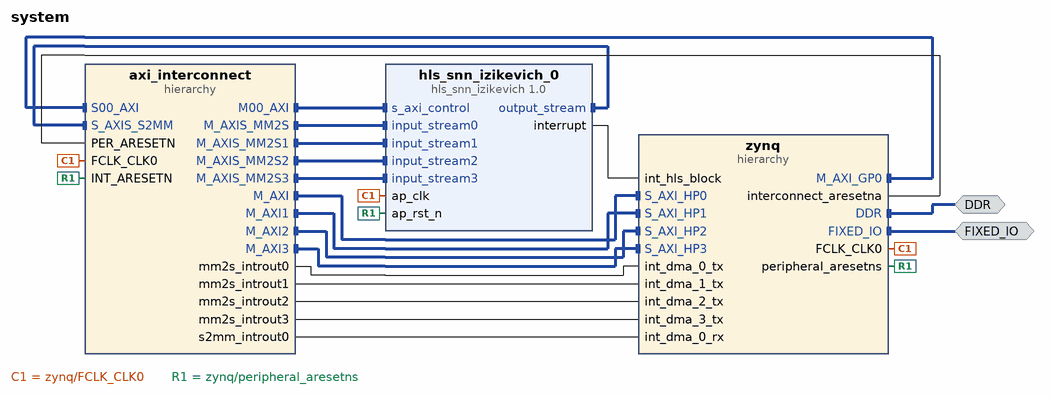
[diagram p0: block diagram of the top level]
# Vivado block design system, Vivado 2015.4
create_bd_design system

create_bd_intf_port -mode Master -vlnv xilinx.com:interface:ddrx_rtl:1.0 DDR
create_bd_intf_port -mode Master -vlnv xilinx.com:display_processing_system7:fixedio_rtl:1.0 FIXED_IO

create_bd_cell -type hier zynq
create_bd_cell -type hier axi_interconnect
create_bd_cell -type ip -vlnv xilinx.com:hls:hls_snn_izikevich:1.0 hls_snn_izikevich_0

# ---- hierarchy /zynq ----
current_bd_instance /zynq
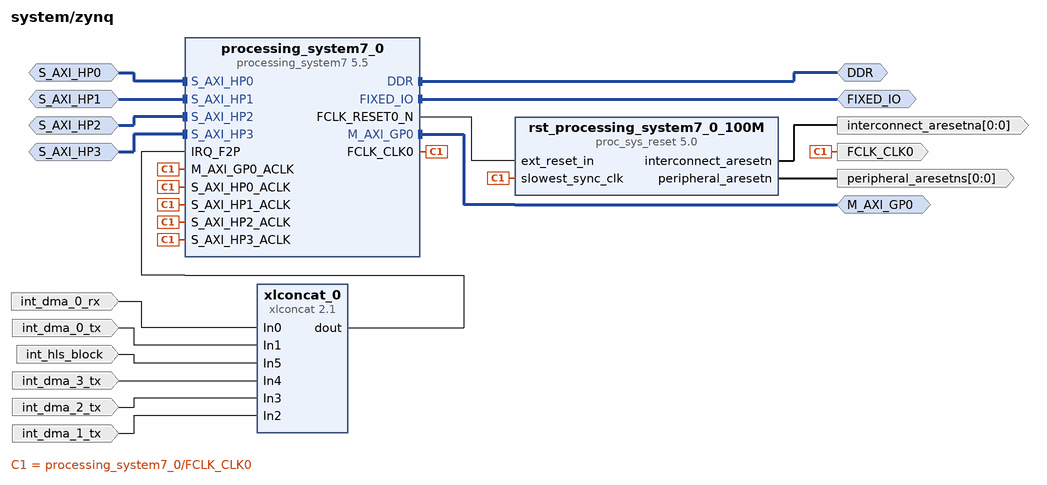
[diagram p1: block diagram inside /zynq]
create_bd_intf_pin -mode Master -vlnv xilinx.com:interface:ddrx_rtl:1.0 DDR
create_bd_intf_pin -mode Master -vlnv xilinx.com:display_processing_system7:fixedio_rtl:1.0 FIXED_IO
create_bd_intf_pin -mode Master -vlnv xilinx.com:interface:aximm_rtl:1.0 M_AXI_GP0
create_bd_intf_pin -mode Slave -vlnv xilinx.com:interface:aximm_rtl:1.0 S_AXI_HP0
create_bd_intf_pin -mode Slave -vlnv xilinx.com:interface:aximm_rtl:1.0 S_AXI_HP1
create_bd_intf_pin -mode Slave -vlnv xilinx.com:interface:aximm_rtl:1.0 S_AXI_HP2
create_bd_intf_pin -mode Slave -vlnv xilinx.com:interface:aximm_rtl:1.0 S_AXI_HP3
create_bd_pin -dir O -type clk FCLK_CLK0
create_bd_pin -dir O -from 0 -to 0 -type rst peripheral_aresetns
create_bd_pin -dir I int_dma_0_rx
create_bd_pin -dir I int_dma_0_tx
create_bd_pin -dir I int_dma_1_tx
create_bd_pin -dir I int_dma_2_tx
create_bd_pin -dir I int_dma_3_tx
create_bd_pin -dir I int_hls_block
create_bd_pin -dir O -from 0 -to 0 -type rst interconnect_aresetna

create_bd_cell -type ip -vlnv xilinx.com:ip:proc_sys_reset:5.0 rst_processing_system7_0_100M
create_bd_cell -type ip -vlnv xilinx.com:ip:processing_system7:5.5 processing_system7_0
set_property -dict [list \
  CONFIG.PCW_FPGA0_PERIPHERAL_FREQMHZ 100 \
  CONFIG.PCW_USE_S_AXI_HP0 1 \
  CONFIG.PCW_USE_S_AXI_HP1 1 \
  CONFIG.PCW_USE_S_AXI_HP2 1 \
  CONFIG.PCW_USE_S_AXI_HP3 1 \
  CONFIG.PCW_USE_FABRIC_INTERRUPT 1 \
  CONFIG.PCW_IRQ_F2P_INTR 1 \
  CONFIG.preset ZedBoard \
] [get_bd_cells processing_system7_0]
create_bd_cell -type ip -vlnv xilinx.com:ip:xlconcat:2.1 xlconcat_0
set_property -dict {CONFIG.NUM_PORTS 6} [get_bd_cells xlconcat_0]

# ---- hierarchy /axi_interconnect ----
current_bd_instance /axi_interconnect
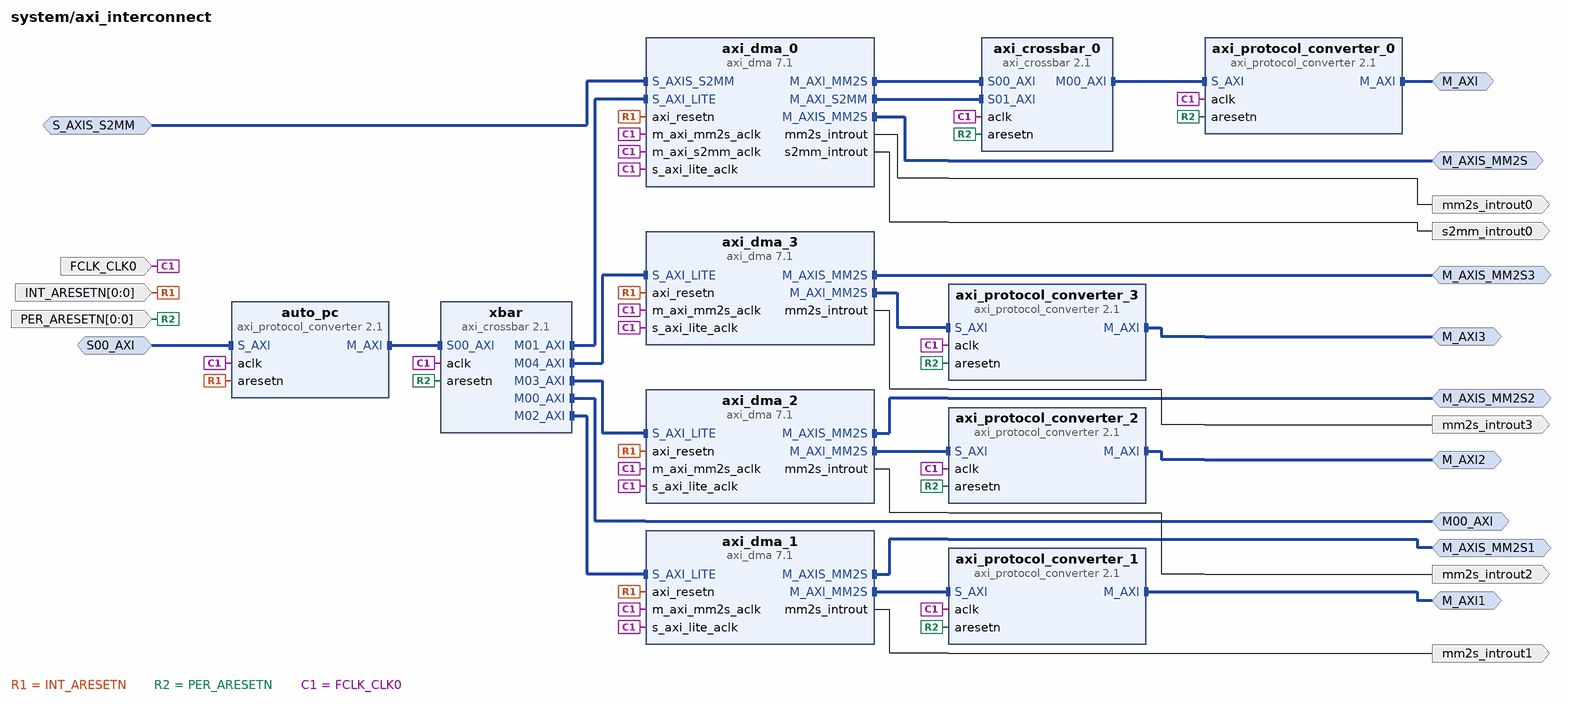
[diagram p2: block diagram inside /axi_interconnect]
create_bd_intf_pin -mode Slave -vlnv xilinx.com:interface:aximm_rtl:1.0 S00_AXI
create_bd_intf_pin -mode Slave -vlnv xilinx.com:interface:axis_rtl:1.0 S_AXIS_S2MM
create_bd_intf_pin -mode Master -vlnv xilinx.com:interface:aximm_rtl:1.0 M00_AXI
create_bd_intf_pin -mode Master -vlnv xilinx.com:interface:axis_rtl:1.0 M_AXIS_MM2S
create_bd_intf_pin -mode Master -vlnv xilinx.com:interface:axis_rtl:1.0 M_AXIS_MM2S1
create_bd_intf_pin -mode Master -vlnv xilinx.com:interface:axis_rtl:1.0 M_AXIS_MM2S2
create_bd_intf_pin -mode Master -vlnv xilinx.com:interface:axis_rtl:1.0 M_AXIS_MM2S3
create_bd_intf_pin -mode Master -vlnv xilinx.com:interface:aximm_rtl:1.0 M_AXI
create_bd_intf_pin -mode Master -vlnv xilinx.com:interface:aximm_rtl:1.0 M_AXI1
create_bd_intf_pin -mode Master -vlnv xilinx.com:interface:aximm_rtl:1.0 M_AXI2
create_bd_intf_pin -mode Master -vlnv xilinx.com:interface:aximm_rtl:1.0 M_AXI3
create_bd_pin -dir I -type clk FCLK_CLK0
create_bd_pin -dir I -from 0 -to 0 -type rst INT_ARESETN
create_bd_pin -dir I -from 0 -to 0 -type rst PER_ARESETN
create_bd_pin -dir O s2mm_introut0
create_bd_pin -dir O mm2s_introut0
create_bd_pin -dir O mm2s_introut1
create_bd_pin -dir O mm2s_introut2
create_bd_pin -dir O mm2s_introut3

create_bd_cell -type ip -vlnv xilinx.com:ip:axi_crossbar:2.1 axi_crossbar_0
set_property -dict {CONFIG.NUM_SI 2 CONFIG.NUM_MI 1} [get_bd_cells axi_crossbar_0]
create_bd_cell -type ip -vlnv xilinx.com:ip:axi_protocol_converter:2.1 axi_protocol_converter_0
create_bd_cell -type ip -vlnv xilinx.com:ip:axi_protocol_converter:2.1 axi_protocol_converter_1
create_bd_cell -type ip -vlnv xilinx.com:ip:axi_dma:7.1 axi_dma_0
set_property -dict [list \
  CONFIG.c_include_sg 0 \
  CONFIG.c_m_axi_mm2s_data_width 64 \
  CONFIG.c_m_axis_mm2s_tdata_width 64 \
  CONFIG.c_include_mm2s_dre 1 \
  CONFIG.c_mm2s_burst_size 256 \
  CONFIG.c_include_s2mm_dre 1 \
  CONFIG.c_s2mm_burst_size 256 \
] [get_bd_cells axi_dma_0]
create_bd_cell -type ip -vlnv xilinx.com:ip:axi_protocol_converter:2.1 axi_protocol_converter_2
create_bd_cell -type ip -vlnv xilinx.com:ip:axi_dma:7.1 axi_dma_1
set_property -dict [list \
  CONFIG.c_include_sg 0 \
  CONFIG.c_m_axi_mm2s_data_width 64 \
  CONFIG.c_m_axis_mm2s_tdata_width 64 \
  CONFIG.c_include_mm2s_dre 1 \
  CONFIG.c_mm2s_burst_size 256 \
  CONFIG.c_include_s2mm 0 \
] [get_bd_cells axi_dma_1]
create_bd_cell -type ip -vlnv xilinx.com:ip:axi_protocol_converter:2.1 axi_protocol_converter_3
create_bd_cell -type ip -vlnv xilinx.com:ip:axi_dma:7.1 axi_dma_2
set_property -dict [list \
  CONFIG.c_include_sg 0 \
  CONFIG.c_m_axi_mm2s_data_width 64 \
  CONFIG.c_m_axis_mm2s_tdata_width 64 \
  CONFIG.c_include_mm2s_dre 1 \
  CONFIG.c_mm2s_burst_size 256 \
  CONFIG.c_include_s2mm 0 \
] [get_bd_cells axi_dma_2]
create_bd_cell -type ip -vlnv xilinx.com:ip:axi_dma:7.1 axi_dma_3
set_property -dict [list \
  CONFIG.c_include_sg 0 \
  CONFIG.c_m_axi_mm2s_data_width 64 \
  CONFIG.c_m_axis_mm2s_tdata_width 64 \
  CONFIG.c_include_mm2s_dre 1 \
  CONFIG.c_mm2s_burst_size 256 \
  CONFIG.c_include_s2mm 0 \
] [get_bd_cells axi_dma_3]
create_bd_cell -type ip -vlnv xilinx.com:ip:axi_crossbar:2.1 xbar
set_property -dict {CONFIG.NUM_SI 1 CONFIG.NUM_MI 5 CONFIG.STRATEGY 0} [get_bd_cells xbar]
create_bd_cell -type ip -vlnv xilinx.com:ip:axi_protocol_converter:2.1 auto_pc
set_property -dict {CONFIG.SI_PROTOCOL AXI3 CONFIG.MI_PROTOCOL AXI4LITE} [get_bd_cells auto_pc]

# ---- connections ----

current_bd_instance /zynq
connect_bd_intf_net [get_bd_intf_pins DDR] [get_bd_intf_pins processing_system7_0/DDR]
connect_bd_intf_net [get_bd_intf_pins FIXED_IO] [get_bd_intf_pins processing_system7_0/FIXED_IO]
connect_bd_intf_net [get_bd_intf_pins M_AXI_GP0] [get_bd_intf_pins processing_system7_0/M_AXI_GP0]
connect_bd_intf_net -intf_net S_AXI_HP0_1 [get_bd_intf_pins S_AXI_HP0] [get_bd_intf_pins processing_system7_0/S_AXI_HP0]
connect_bd_intf_net -intf_net S_AXI_HP1_1 [get_bd_intf_pins S_AXI_HP1] [get_bd_intf_pins processing_system7_0/S_AXI_HP1]
connect_bd_intf_net -intf_net S_AXI_HP2_1 [get_bd_intf_pins S_AXI_HP2] [get_bd_intf_pins processing_system7_0/S_AXI_HP2]
connect_bd_intf_net -intf_net S_AXI_HP3_1 [get_bd_intf_pins S_AXI_HP3] [get_bd_intf_pins processing_system7_0/S_AXI_HP3]
connect_bd_net [get_bd_pins processing_system7_0/FCLK_RESET0_N] [get_bd_pins rst_processing_system7_0_100M/ext_reset_in]
connect_bd_net [get_bd_pins processing_system7_0/FCLK_CLK0] \
  [get_bd_pins FCLK_CLK0] [get_bd_pins processing_system7_0/S_AXI_HP0_ACLK] [get_bd_pins processing_system7_0/M_AXI_GP0_ACLK] \
  [get_bd_pins rst_processing_system7_0_100M/slowest_sync_clk] [get_bd_pins processing_system7_0/S_AXI_HP1_ACLK] \
  [get_bd_pins processing_system7_0/S_AXI_HP2_ACLK] [get_bd_pins processing_system7_0/S_AXI_HP3_ACLK]
connect_bd_net [get_bd_pins rst_processing_system7_0_100M/peripheral_aresetn] [get_bd_pins peripheral_aresetns]
connect_bd_net [get_bd_pins xlconcat_0/dout] [get_bd_pins processing_system7_0/IRQ_F2P]
connect_bd_net -net In0_1 [get_bd_pins int_dma_0_rx] [get_bd_pins xlconcat_0/In0]
connect_bd_net -net In1_1 [get_bd_pins int_dma_0_tx] [get_bd_pins xlconcat_0/In1]
connect_bd_net -net In5_1 [get_bd_pins int_hls_block] [get_bd_pins xlconcat_0/In5]
connect_bd_net -net In4_1 [get_bd_pins int_dma_3_tx] [get_bd_pins xlconcat_0/In4]
connect_bd_net -net In3_1 [get_bd_pins int_dma_2_tx] [get_bd_pins xlconcat_0/In3]
connect_bd_net -net In2_1 [get_bd_pins int_dma_1_tx] [get_bd_pins xlconcat_0/In2]
connect_bd_net [get_bd_pins rst_processing_system7_0_100M/interconnect_aresetn] [get_bd_pins interconnect_aresetna]

current_bd_instance /axi_interconnect
connect_bd_intf_net [get_bd_intf_pins axi_crossbar_0/S00_AXI] [get_bd_intf_pins axi_dma_0/M_AXI_MM2S]
connect_bd_intf_net [get_bd_intf_pins axi_protocol_converter_0/S_AXI] [get_bd_intf_pins axi_crossbar_0/M00_AXI]
connect_bd_intf_net [get_bd_intf_pins axi_crossbar_0/S01_AXI] [get_bd_intf_pins axi_dma_0/M_AXI_S2MM]
connect_bd_intf_net [get_bd_intf_pins axi_protocol_converter_1/S_AXI] [get_bd_intf_pins axi_dma_1/M_AXI_MM2S]
connect_bd_intf_net [get_bd_intf_pins axi_protocol_converter_2/S_AXI] [get_bd_intf_pins axi_dma_2/M_AXI_MM2S]
connect_bd_intf_net [get_bd_intf_pins axi_protocol_converter_3/S_AXI] [get_bd_intf_pins axi_dma_3/M_AXI_MM2S]
connect_bd_intf_net [get_bd_intf_pins auto_pc/M_AXI] [get_bd_intf_pins xbar/S00_AXI]
connect_bd_intf_net [get_bd_intf_pins axi_dma_0/S_AXI_LITE] [get_bd_intf_pins xbar/M01_AXI]
connect_bd_intf_net [get_bd_intf_pins axi_dma_1/S_AXI_LITE] [get_bd_intf_pins xbar/M02_AXI]
connect_bd_intf_net [get_bd_intf_pins axi_dma_2/S_AXI_LITE] [get_bd_intf_pins xbar/M03_AXI]
connect_bd_intf_net [get_bd_intf_pins axi_dma_3/S_AXI_LITE] [get_bd_intf_pins xbar/M04_AXI]
connect_bd_intf_net [get_bd_intf_pins S00_AXI] [get_bd_intf_pins auto_pc/S_AXI]
connect_bd_intf_net [get_bd_intf_pins S_AXIS_S2MM] [get_bd_intf_pins axi_dma_0/S_AXIS_S2MM]
connect_bd_intf_net [get_bd_intf_pins M00_AXI] [get_bd_intf_pins xbar/M00_AXI]
connect_bd_intf_net [get_bd_intf_pins M_AXIS_MM2S] [get_bd_intf_pins axi_dma_0/M_AXIS_MM2S]
connect_bd_intf_net [get_bd_intf_pins M_AXIS_MM2S1] [get_bd_intf_pins axi_dma_1/M_AXIS_MM2S]
connect_bd_intf_net [get_bd_intf_pins M_AXIS_MM2S2] [get_bd_intf_pins axi_dma_2/M_AXIS_MM2S]
connect_bd_intf_net [get_bd_intf_pins M_AXIS_MM2S3] [get_bd_intf_pins axi_dma_3/M_AXIS_MM2S]
connect_bd_intf_net [get_bd_intf_pins M_AXI] [get_bd_intf_pins axi_protocol_converter_0/M_AXI]
connect_bd_intf_net [get_bd_intf_pins M_AXI1] [get_bd_intf_pins axi_protocol_converter_1/M_AXI]
connect_bd_intf_net [get_bd_intf_pins M_AXI2] [get_bd_intf_pins axi_protocol_converter_2/M_AXI]
connect_bd_intf_net [get_bd_intf_pins M_AXI3] [get_bd_intf_pins axi_protocol_converter_3/M_AXI]
connect_bd_net -net rst_processing_system7_0_100M_peripheral_aresetn [get_bd_pins INT_ARESETN] \
  [get_bd_pins axi_dma_1/axi_resetn] [get_bd_pins axi_dma_2/axi_resetn] [get_bd_pins axi_dma_3/axi_resetn] \
  [get_bd_pins axi_dma_0/axi_resetn] [get_bd_pins auto_pc/aresetn]
connect_bd_net -net rst_processing_system7_0_100M_interconnect_aresetn [get_bd_pins PER_ARESETN] \
  [get_bd_pins axi_crossbar_0/aresetn] [get_bd_pins axi_protocol_converter_3/aresetn] \
  [get_bd_pins axi_protocol_converter_2/aresetn] [get_bd_pins axi_protocol_converter_1/aresetn] \
  [get_bd_pins axi_protocol_converter_0/aresetn] [get_bd_pins xbar/aresetn]
connect_bd_net [get_bd_pins axi_dma_0/s2mm_introut] [get_bd_pins s2mm_introut0]
connect_bd_net [get_bd_pins axi_dma_0/mm2s_introut] [get_bd_pins mm2s_introut0]
connect_bd_net [get_bd_pins axi_dma_1/mm2s_introut] [get_bd_pins mm2s_introut1]
connect_bd_net [get_bd_pins axi_dma_2/mm2s_introut] [get_bd_pins mm2s_introut2]
connect_bd_net [get_bd_pins axi_dma_3/mm2s_introut] [get_bd_pins mm2s_introut3]
connect_bd_net -net processing_system7_0_FCLK_CLK0 [get_bd_pins FCLK_CLK0] \
  [get_bd_pins axi_dma_1/s_axi_lite_aclk] [get_bd_pins axi_dma_2/s_axi_lite_aclk] [get_bd_pins axi_dma_3/s_axi_lite_aclk] \
  [get_bd_pins axi_dma_0/s_axi_lite_aclk] [get_bd_pins axi_dma_1/m_axi_mm2s_aclk] [get_bd_pins axi_dma_2/m_axi_mm2s_aclk] \
  [get_bd_pins axi_dma_3/m_axi_mm2s_aclk] [get_bd_pins axi_crossbar_0/aclk] [get_bd_pins axi_protocol_converter_3/aclk] \
  [get_bd_pins axi_protocol_converter_2/aclk] [get_bd_pins axi_protocol_converter_1/aclk] \
  [get_bd_pins axi_protocol_converter_0/aclk] [get_bd_pins axi_dma_0/m_axi_mm2s_aclk] [get_bd_pins axi_dma_0/m_axi_s2mm_aclk] \
  [get_bd_pins auto_pc/aclk] [get_bd_pins xbar/aclk]

current_bd_instance /
connect_bd_intf_net -intf_net processing_system7_0_M_AXI_GP0 [get_bd_intf_pins zynq/M_AXI_GP0] [get_bd_intf_pins axi_interconnect/S00_AXI]
connect_bd_intf_net [get_bd_intf_pins hls_snn_izikevich_0/output_stream] [get_bd_intf_pins axi_interconnect/S_AXIS_S2MM]
connect_bd_intf_net [get_bd_intf_pins hls_snn_izikevich_0/s_axi_control] [get_bd_intf_pins axi_interconnect/M00_AXI]
connect_bd_intf_net [get_bd_intf_pins hls_snn_izikevich_0/input_stream0] [get_bd_intf_pins axi_interconnect/M_AXIS_MM2S]
connect_bd_intf_net [get_bd_intf_pins hls_snn_izikevich_0/input_stream1] [get_bd_intf_pins axi_interconnect/M_AXIS_MM2S1]
connect_bd_intf_net [get_bd_intf_pins hls_snn_izikevich_0/input_stream2] [get_bd_intf_pins axi_interconnect/M_AXIS_MM2S2]
connect_bd_intf_net [get_bd_intf_pins hls_snn_izikevich_0/input_stream3] [get_bd_intf_pins axi_interconnect/M_AXIS_MM2S3]
connect_bd_intf_net -intf_net S_AXI_HP0_1 [get_bd_intf_pins zynq/S_AXI_HP0] [get_bd_intf_pins axi_interconnect/M_AXI]
connect_bd_intf_net -intf_net S_AXI_HP1_1 [get_bd_intf_pins zynq/S_AXI_HP1] [get_bd_intf_pins axi_interconnect/M_AXI1]
connect_bd_intf_net -intf_net S_AXI_HP2_1 [get_bd_intf_pins zynq/S_AXI_HP2] [get_bd_intf_pins axi_interconnect/M_AXI2]
connect_bd_intf_net -intf_net S_AXI_HP3_1 [get_bd_intf_pins zynq/S_AXI_HP3] [get_bd_intf_pins axi_interconnect/M_AXI3]
connect_bd_intf_net -intf_net processing_system7_0_DDR [get_bd_intf_ports DDR] [get_bd_intf_pins zynq/DDR]
connect_bd_intf_net -intf_net processing_system7_0_FIXED_IO [get_bd_intf_ports FIXED_IO] [get_bd_intf_pins zynq/FIXED_IO]
connect_bd_net -net processing_system7_0_FCLK_CLK0 [get_bd_pins zynq/FCLK_CLK0] \
  [get_bd_pins axi_interconnect/FCLK_CLK0] [get_bd_pins hls_snn_izikevich_0/ap_clk]
connect_bd_net -net rst_processing_system7_0_100M_peripheral_aresetn [get_bd_pins zynq/peripheral_aresetns] \
  [get_bd_pins axi_interconnect/INT_ARESETN] [get_bd_pins hls_snn_izikevich_0/ap_rst_n]
connect_bd_net -net rst_processing_system7_0_100M_interconnect_aresetn [get_bd_pins zynq/interconnect_aresetna] \
  [get_bd_pins axi_interconnect/PER_ARESETN]
connect_bd_net [get_bd_pins axi_interconnect/mm2s_introut0] [get_bd_pins zynq/int_dma_0_tx]
connect_bd_net [get_bd_pins axi_interconnect/mm2s_introut1] [get_bd_pins zynq/int_dma_1_tx]
connect_bd_net [get_bd_pins axi_interconnect/mm2s_introut2] [get_bd_pins zynq/int_dma_2_tx]
connect_bd_net [get_bd_pins axi_interconnect/mm2s_introut3] [get_bd_pins zynq/int_dma_3_tx]
connect_bd_net [get_bd_pins hls_snn_izikevich_0/interrupt] [get_bd_pins zynq/int_hls_block]
connect_bd_net -net int_dma_0_rx_1 [get_bd_pins axi_interconnect/s2mm_introut0] [get_bd_pins zynq/int_dma_0_rx]

# ---- address map ----
assign_bd_address -offset 0x00000000 -range 512M -target_address_space [get_bd_addr_spaces axi_interconnect/axi_dma_0/Data_MM2S] [get_bd_addr_segs zynq/processing_system7_0/S_AXI_HP0/HP0_DDR_LOWOCM]
assign_bd_address -offset 0x00000000 -range 512M -target_address_space [get_bd_addr_spaces axi_interconnect/axi_dma_0/Data_S2MM] [get_bd_addr_segs zynq/processing_system7_0/S_AXI_HP0/HP0_DDR_LOWOCM]
assign_bd_address -offset 0x00000000 -range 512M -target_address_space [get_bd_addr_spaces axi_interconnect/axi_dma_1/Data_MM2S] [get_bd_addr_segs zynq/processing_system7_0/S_AXI_HP1/HP1_DDR_LOWOCM]
assign_bd_address -offset 0x00000000 -range 512M -target_address_space [get_bd_addr_spaces axi_interconnect/axi_dma_2/Data_MM2S] [get_bd_addr_segs zynq/processing_system7_0/S_AXI_HP2/HP2_DDR_LOWOCM]
assign_bd_address -offset 0x00000000 -range 512M -target_address_space [get_bd_addr_spaces axi_interconnect/axi_dma_3/Data_MM2S] [get_bd_addr_segs zynq/processing_system7_0/S_AXI_HP3/HP3_DDR_LOWOCM]
assign_bd_address -offset 0x40400000 -range 64K -target_address_space [get_bd_addr_spaces zynq/processing_system7_0/Data] [get_bd_addr_segs axi_interconnect/axi_dma_0/S_AXI_LITE/Reg]
assign_bd_address -offset 0x40410000 -range 64K -target_address_space [get_bd_addr_spaces zynq/processing_system7_0/Data] [get_bd_addr_segs axi_interconnect/axi_dma_1/S_AXI_LITE/Reg]
assign_bd_address -offset 0x40420000 -range 64K -target_address_space [get_bd_addr_spaces zynq/processing_system7_0/Data] [get_bd_addr_segs axi_interconnect/axi_dma_2/S_AXI_LITE/Reg]
assign_bd_address -offset 0x40430000 -range 64K -target_address_space [get_bd_addr_spaces zynq/processing_system7_0/Data] [get_bd_addr_segs axi_interconnect/axi_dma_3/S_AXI_LITE/Reg]
assign_bd_address -offset 0x43C00000 -range 64K -target_address_space [get_bd_addr_spaces zynq/processing_system7_0/Data] [get_bd_addr_segs hls_snn_izikevich_0/s_axi_control/Reg]

validate_bd_design
save_bd_design
